# EAGLE design Breadboard (EAGLE 9.4.2)
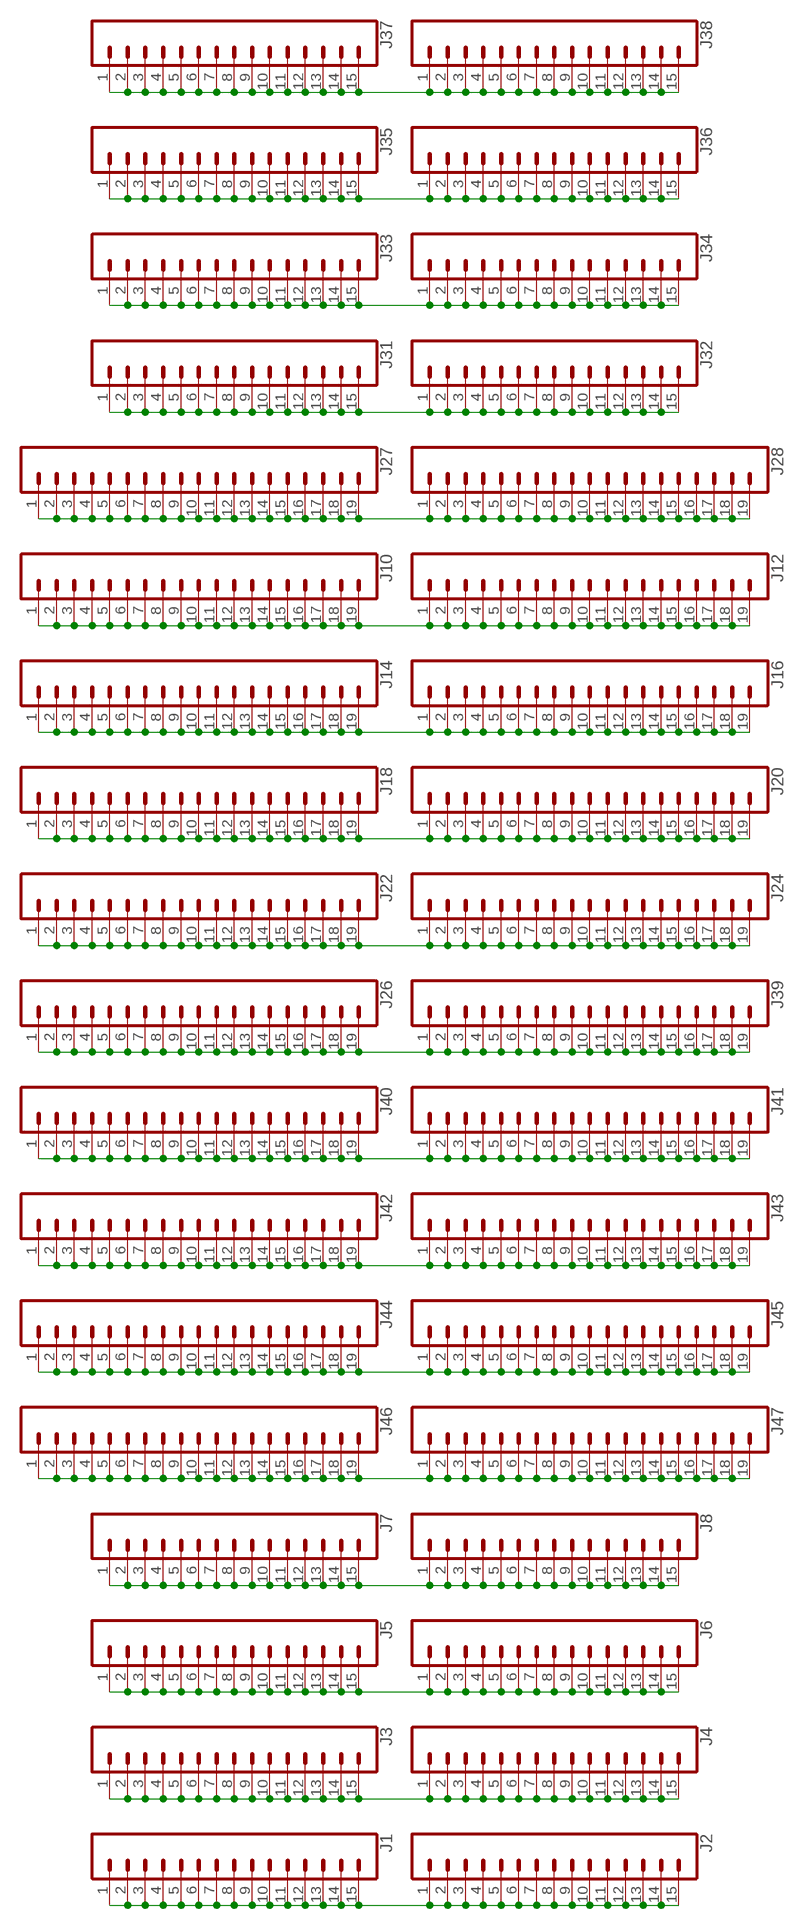
[diagram p0: schematic, sheet 1]

## Parts
J1  CONN_15  [1X15]
J2  CONN_15  [1X15]
J3  CONN_15  [1X15]
J4  CONN_15  [1X15]
J5  CONN_15  [1X15]
J6  CONN_15  [1X15]
J7  CONN_15  [1X15]
J8  CONN_15  [1X15]
J10  CONN_19  [1X19]
J12  CONN_19  [1X19]
J14  CONN_19  [1X19]
J16  CONN_19  [1X19]
J18  CONN_19  [1X19]
J20  CONN_19  [1X19]
J22  CONN_19  [1X19]
J24  CONN_19  [1X19]
J26  CONN_19  [1X19]
J27  CONN_19  [1X19]
J28  CONN_19  [1X19]
J31  CONN_15  [1X15]
J32  CONN_15  [1X15]
J33  CONN_15  [1X15]
J34  CONN_15  [1X15]
J35  CONN_15  [1X15]
J36  CONN_15  [1X15]
J37  CONN_15  [1X15]
J38  CONN_15  [1X15]
J39  CONN_19  [1X19]
J40  CONN_19  [1X19]
J41  CONN_19  [1X19]
J42  CONN_19  [1X19]
J43  CONN_19  [1X19]
J44  CONN_19  [1X19]
J45  CONN_19  [1X19]
J46  CONN_19  [1X19]
J47  CONN_19  [1X19]

## Nets
N$1: J37.1 J37.2 J37.3 J37.4 J37.5 J37.6 J37.7 J37.8 J37.9 J37.10 J37.11 J37.12 J37.13 J37.14 J37.15 J38.1 J38.2 J38.3 J38.4 J38.5 J38.6 J38.7 J38.8 J38.9 J38.10 J38.11 J38.12 J38.13 J38.14 J38.15
N$2: J35.1 J35.2 J35.3 J35.4 J35.5 J35.6 J35.7 J35.8 J35.9 J35.10 J35.11 J35.12 J35.13 J35.14 J35.15 J36.1 J36.2 J36.3 J36.4 J36.5 J36.6 J36.7 J36.8 J36.9 J36.10 J36.11 J36.12 J36.13 J36.14 J36.15
N$3: J33.1 J33.2 J33.3 J33.4 J33.5 J33.6 J33.7 J33.8 J33.9 J33.10 J33.11 J33.12 J33.13 J33.14 J33.15 J34.1 J34.2 J34.3 J34.4 J34.5 J34.6 J34.7 J34.8 J34.9 J34.10 J34.11 J34.12 J34.13 J34.14 J34.15
N$4: J31.1 J31.2 J31.3 J31.4 J31.5 J31.6 J31.7 J31.8 J31.9 J31.10 J31.11 J31.12 J31.13 J31.14 J31.15 J32.1 J32.2 J32.3 J32.4 J32.5 J32.6 J32.7 J32.8 J32.9 J32.10 J32.11 J32.12 J32.13 J32.14 J32.15
N$6: J27.1 J27.2 J27.3 J27.4 J27.5 J27.6 J27.7 J27.8 J27.9 J27.10 J27.11 J27.12 J27.13 J27.14 J27.15 J27.16 J27.17 J27.18 J27.19 J28.1 J28.2 J28.3 J28.4 J28.5 J28.6 J28.7 J28.8 J28.9 J28.10 J28.11 J28.12 J28.13 J28.14 J28.15 J28.16 J28.17 J28.18 J28.19
N$7: J10.1 J10.2 J10.3 J10.4 J10.5 J10.6 J10.7 J10.8 J10.9 J10.10 J10.11 J10.12 J10.13 J10.14 J10.15 J10.16 J10.17 J10.18 J10.19 J12.1 J12.2 J12.3 J12.4 J12.5 J12.6 J12.7 J12.8 J12.9 J12.10 J12.11 J12.12 J12.13 J12.14 J12.15 J12.16 J12.17 J12.18 J12.19
N$8: J14.1 J14.2 J14.3 J14.4 J14.5 J14.6 J14.7 J14.8 J14.9 J14.10 J14.11 J14.12 J14.13 J14.14 J14.15 J14.16 J14.17 J14.18 J14.19 J16.1 J16.2 J16.3 J16.4 J16.5 J16.6 J16.7 J16.8 J16.9 J16.10 J16.11 J16.12 J16.13 J16.14 J16.15 J16.16 J16.17 J16.18 J16.19
N$9: J18.1 J18.2 J18.3 J18.4 J18.5 J18.6 J18.7 J18.8 J18.9 J18.10 J18.11 J18.12 J18.13 J18.14 J18.15 J18.16 J18.17 J18.18 J18.19 J20.1 J20.2 J20.3 J20.4 J20.5 J20.6 J20.7 J20.8 J20.9 J20.10 J20.11 J20.12 J20.13 J20.14 J20.15 J20.16 J20.17 J20.18 J20.19
N$10: J22.1 J22.2 J22.3 J22.4 J22.5 J22.6 J22.7 J22.8 J22.9 J22.10 J22.11 J22.12 J22.13 J22.14 J22.15 J22.16 J22.17 J22.18 J22.19 J24.1 J24.2 J24.3 J24.4 J24.5 J24.6 J24.7 J24.8 J24.9 J24.10 J24.11 J24.12 J24.13 J24.14 J24.15 J24.16 J24.17 J24.18 J24.19
N$11: J26.1 J26.2 J26.3 J26.4 J26.5 J26.6 J26.7 J26.8 J26.9 J26.10 J26.11 J26.12 J26.13 J26.14 J26.15 J26.16 J26.17 J26.18 J26.19 J39.1 J39.2 J39.3 J39.4 J39.5 J39.6 J39.7 J39.8 J39.9 J39.10 J39.11 J39.12 J39.13 J39.14 J39.15 J39.16 J39.17 J39.18 J39.19
N$12: J40.1 J40.2 J40.3 J40.4 J40.5 J40.6 J40.7 J40.8 J40.9 J40.10 J40.11 J40.12 J40.13 J40.14 J40.15 J40.16 J40.17 J40.18 J40.19 J41.1 J41.2 J41.3 J41.4 J41.5 J41.6 J41.7 J41.8 J41.9 J41.10 J41.11 J41.12 J41.13 J41.14 J41.15 J41.16 J41.17 J41.18 J41.19
N$13: J42.1 J42.2 J42.3 J42.4 J42.5 J42.6 J42.7 J42.8 J42.9 J42.10 J42.11 J42.12 J42.13 J42.14 J42.15 J42.16 J42.17 J42.18 J42.19 J43.1 J43.2 J43.3 J43.4 J43.5 J43.6 J43.7 J43.8 J43.9 J43.10 J43.11 J43.12 J43.13 J43.14 J43.15 J43.16 J43.17 J43.18 J43.19
N$14: J44.1 J44.2 J44.3 J44.4 J44.5 J44.6 J44.7 J44.8 J44.9 J44.10 J44.11 J44.12 J44.13 J44.14 J44.15 J44.16 J44.17 J44.18 J44.19 J45.1 J45.2 J45.3 J45.4 J45.5 J45.6 J45.7 J45.8 J45.9 J45.10 J45.11 J45.12 J45.13 J45.14 J45.15 J45.16 J45.17 J45.18 J45.19
N$15: J46.1 J46.2 J46.3 J46.4 J46.5 J46.6 J46.7 J46.8 J46.9 J46.10 J46.11 J46.12 J46.13 J46.14 J46.15 J46.16 J46.17 J46.18 J46.19 J47.1 J47.2 J47.3 J47.4 J47.5 J47.6 J47.7 J47.8 J47.9 J47.10 J47.11 J47.12 J47.13 J47.14 J47.15 J47.16 J47.17 J47.18 J47.19
N$16: J7.1 J7.2 J7.3 J7.4 J7.5 J7.6 J7.7 J7.8 J7.9 J7.10 J7.11 J7.12 J7.13 J7.14 J7.15 J8.1 J8.2 J8.3 J8.4 J8.5 J8.6 J8.7 J8.8 J8.9 J8.10 J8.11 J8.12 J8.13 J8.14 J8.15
N$17: J5.1 J5.2 J5.3 J5.4 J5.5 J5.6 J5.7 J5.8 J5.9 J5.10 J5.11 J5.12 J5.13 J5.14 J5.15 J6.1 J6.2 J6.3 J6.4 J6.5 J6.6 J6.7 J6.8 J6.9 J6.10 J6.11 J6.12 J6.13 J6.14 J6.15
N$18: J3.1 J3.2 J3.3 J3.4 J3.5 J3.6 J3.7 J3.8 J3.9 J3.10 J3.11 J3.12 J3.13 J3.14 J3.15 J4.1 J4.2 J4.3 J4.4 J4.5 J4.6 J4.7 J4.8 J4.9 J4.10 J4.11 J4.12 J4.13 J4.14 J4.15
N$19: J1.1 J1.2 J1.3 J1.4 J1.5 J1.6 J1.7 J1.8 J1.9 J1.10 J1.11 J1.12 J1.13 J1.14 J1.15 J2.1 J2.2 J2.3 J2.4 J2.5 J2.6 J2.7 J2.8 J2.9 J2.10 J2.11 J2.12 J2.13 J2.14 J2.15

## Library data of the parts
J1-J8 J31-J38 = SparkFun-Connectors:CONN_15: Multi connection point. Often used as Generic Header-pin footprint for 0.1 inch spaced/style header connections On any of the 0.1 inch spaced packages, you can populate with these: Break Away Headers - Straight <https://www.sparkfun.com/products/116> (PRT-00116) Break Away Male Headers - Right Angle <https://www.sparkfun.com/products/553> (PRT-00553) Female Headers <https://www.sparkfun.com/products/115> (PRT-00115) Break Away Headers - Machine Pin <https://www.sparkfun.com/products/117> (PRT-00117) Break Away Female Headers - Swiss Machine Pin <https://www.sparkfun.com/products/743> (PRT-00743) For SCREWTERMINALS and SPRING TERMINALS visit here: Screw Terimnals on SparkFun.com <https://www.sparkfun.com/search/results?term=Screw+Terminals> (5mm/3.5mm/2.54mm spacing) This device is also useful as a general connection point to wire up your design to another part of your project. Our various solder wires solder well into these plated through hole pads. Hook-Up Wire - Assortment (Stranded, 22 AWG) <https://www.sparkfun.com/products/11375> (PRT-11375) Hook-Up Wire - Assortment (Solid Core, 22 AWG) <https://www.sparkfun.com/products/11367> (PRT-11367) View the entire wire category on our website here <https://www.sparkfun.com/categories/141> Special notes: Molex polarized connector foot print use with SKU : PRT-08231 with associated crimp pins and housings. 1MM SMD Version SKU: PRT-10208 NOTES ON THE VARIANTS LOCK and LOCK_LONGPADS... This footprint was designed to help hold the alignment of a through-hole component (i.e. 6-pin header) while soldering it into place. You may notice that each hole has been shifted either up or down by 0.005 of an inch from it's more standard position (which is a perfectly straight line). This slight alteration caused the pins (the squares in the middle) to touch the edges of the holes. Because they are alternating, it causes a "brace" to hold the component in place. 0.005 has proven to be the perfect amount of "off-center" position when using our standard breakaway headers. Although looks a little odd when you look at the bare footprint, once you have a header in there, the alteration is very hard to notice. Also,if you push a header all the way into place, it is covered up entirely on the bottom side.
J10 J12 J14 J16 J18 J20 J22 J24 J26-J28 J39-J47 = SparkFun-Connectors:CONN_19: Multi connection point. Often used as Generic Header-pin footprint for 0.1 inch spaced/style header connections On any of the 0.1 inch spaced packages, you can populate with these: Break Away Headers - Straight <https://www.sparkfun.com/products/116> (PRT-00116) Break Away Male Headers - Right Angle <https://www.sparkfun.com/products/553> (PRT-00553) Female Headers <https://www.sparkfun.com/products/115> (PRT-00115) Break Away Headers - Machine Pin <https://www.sparkfun.com/products/117> (PRT-00117) Break Away Female Headers - Swiss Machine Pin <https://www.sparkfun.com/products/743> (PRT-00743) For SCREWTERMINALS and SPRING TERMINALS visit here: Screw Terimnals on SparkFun.com <https://www.sparkfun.com/search/results?term=Screw+Terminals> (5mm/3.5mm/2.54mm spacing) This device is also useful as a general connection point to wire up your design to another part of your project. Our various solder wires solder well into these plated through hole pads. Hook-Up Wire - Assortment (Stranded, 22 AWG) <https://www.sparkfun.com/products/11375> (PRT-11375) Hook-Up Wire - Assortment (Solid Core, 22 AWG) <https://www.sparkfun.com/products/11367> (PRT-11367) View the entire wire category on our website here <https://www.sparkfun.com/categories/141> Special notes: Molex polarized connector foot print use with SKU : PRT-08231 with associated crimp pins and housings. 1MM SMD Version SKU: PRT-10208 NOTES ON THE VARIANTS LOCK and LOCK_LONGPADS... This footprint was designed to help hold the alignment of a through-hole component (i.e. 6-pin header) while soldering it into place. You may notice that each hole has been shifted either up or down by 0.005 of an inch from it's more standard position (which is a perfectly straight line). This slight alteration caused the pins (the squares in the middle) to touch the edges of the holes. Because they are alternating, it causes a "brace" to hold the component in place. 0.005 has proven to be the perfect amount of "off-center" position when using our standard breakaway headers. Although looks a little odd when you look at the bare footprint, once you have a header in there, the alteration is very hard to notice. Also,if you push a header all the way into place, it is covered up entirely on the bottom side.

## Board
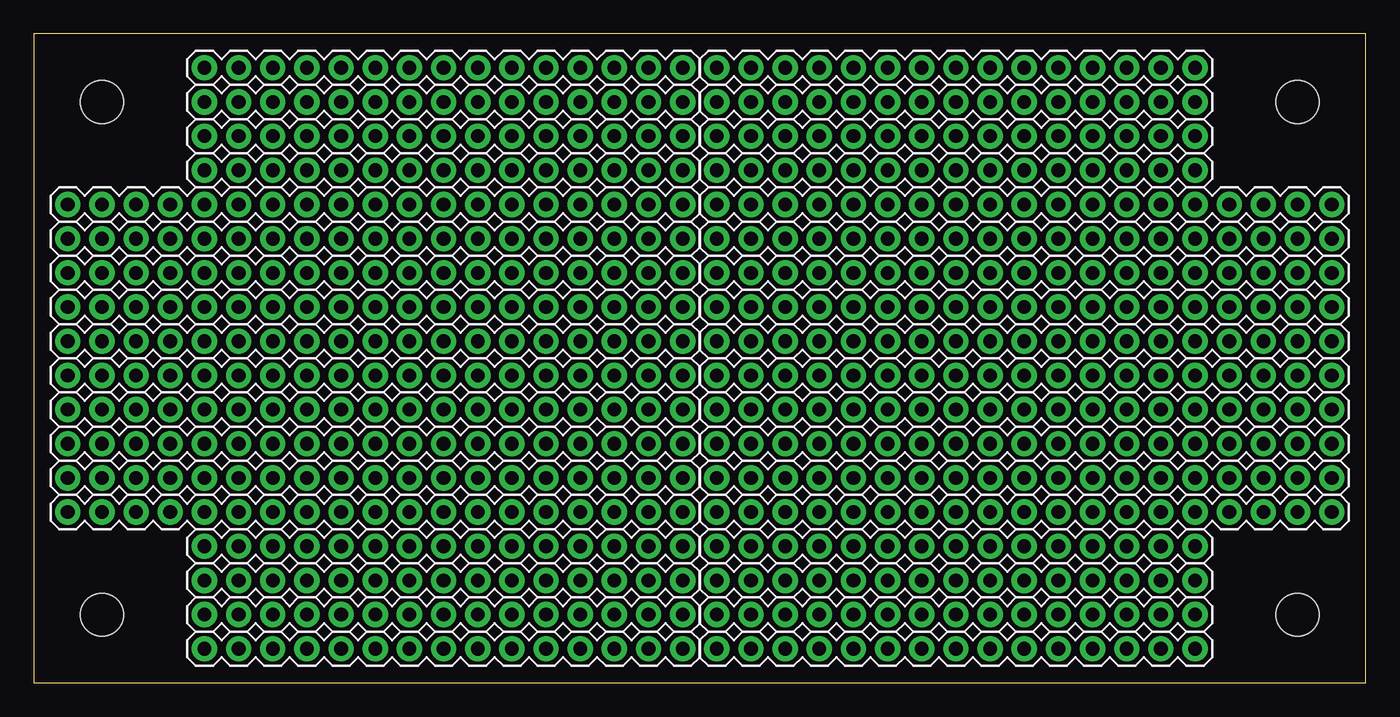
[diagram p1: board, top side]
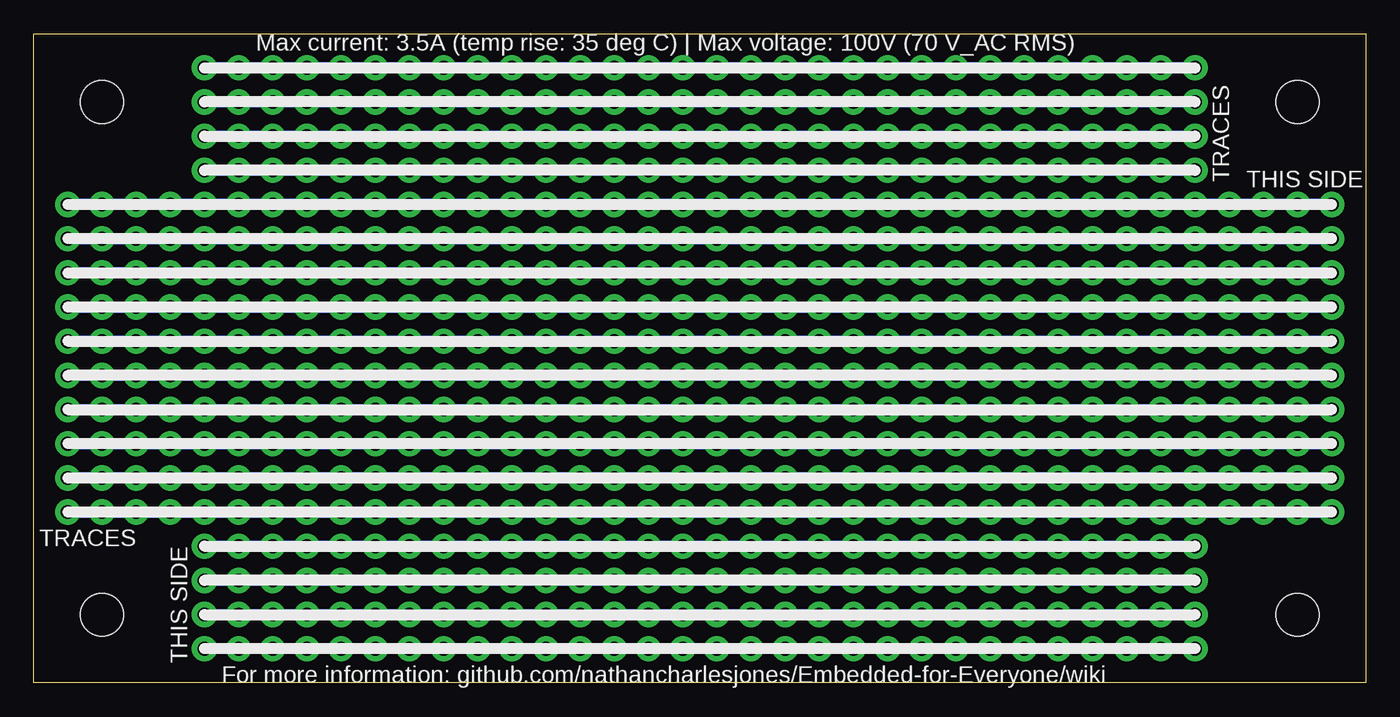
[diagram p2: board, bottom side, seen from below]

Size 99.06 x 48.26 mm. Coordinates in mm from the lower left corner, seen from the top.
Outline: 0,0 99.06,0 99.06,48.26 0,48.26 0,0
Copper layers (1*16): Top 0.035mm / dielectric 1.5mm / Bottom 0.035mm
Design rules "OthermillDRC_1_64_v2": minimum track width 16mil, minimum drill 31mil, track to track 0.39878125mm, track to pad 0.39878125mm, pad to pad 0.39878125mm, via to via 0.39878125mm, smd to smd 0mil, copper to edge 0mil, drill to drill 1mil, minimum pad ring 0mil, minimum via ring 15mil, stop-mask expansion 1mil, vias tented up to drill 30mil, thermal gap 10mil
Holes 3.17 mm at 93.98,43.18 93.98,5.08 5.08,43.18 5.08,5.08

### Footprints (pad centres in the part's own frame; a part is rotated, then mirrored left to right if it is on the bottom)
1X15 = drill 1.016 pad 1.88: 1 0,0; 2 2.54,0; 3 5.08,0; 4 7.62,0; 5 10.16,0; 6 12.7,0; 7 15.24,0; 8 17.78,0; 9 20.32,0; 10 22.86,0; 11 25.4,0; 12 27.94,0; 13 30.48,0; 14 33.02,0; 15 35.56,0
1X19 = drill 1.016 pad 1.88: 1 0,0; 2 2.54,0; 3 5.08,0; 4 7.62,0; 5 10.16,0; 6 12.7,0; 7 15.24,0; 8 17.78,0; 9 20.32,0; 10 22.86,0; 11 25.4,0; 12 27.94,0; 13 30.48,0; 14 33.02,0; 15 35.56,0; 16 38.1,0; 17 40.64,0; 18 43.18,0; 19 45.72,0

### Placement (x,y rotation side)
J1  12.7,2.54 0 top
J2  50.8,2.54 0 top
J3  12.7,5.08 0 top
J4  50.8,5.08 0 top
J5  12.7,7.62 0 top
J6  50.8,7.62 0 top
J7  12.7,10.16 0 top
J8  50.8,10.16 0 top
J10  2.54,33.02 0 top
J12  50.8,33.02 0 top
J14  2.54,30.48 0 top
J16  50.8,30.48 0 top
J18  2.54,27.94 0 top
J20  50.8,27.94 0 top
J22  2.54,25.4 0 top
J24  50.8,25.4 0 top
J26  2.54,22.86 0 top
J27  2.54,35.56 0 top
J28  50.8,35.56 0 top
J31  12.7,38.1 0 top
J32  50.8,38.1 0 top
J33  12.7,40.64 0 top
J34  50.8,40.64 0 top
J35  12.7,43.18 0 top
J36  50.8,43.18 0 top
J37  12.7,45.72 0 top
J38  50.8,45.72 0 top
J39  50.8,22.86 0 top
J40  2.54,20.32 0 top
J41  50.8,20.32 0 top
J42  2.54,17.78 0 top
J43  50.8,17.78 0 top
J44  2.54,15.24 0 top
J45  50.8,15.24 0 top
J46  2.54,12.7 0 top
J47  50.8,12.7 0 top

### Tracks (layer width: path | path; a pad name or v marks a point on that pad's centre or on a via)
N$1
  Bottom 0.813: J37.1 J37.2 J37.3 J37.4 J37.5 J37.6 J37.7 J37.8 J37.9 J37.10 J37.11 J37.12 J37.13 J37.14 J37.15 J38.1 J38.2 J38.3 J38.4 J38.5 J38.6 J38.7 J38.8 J38.9 J38.10 J38.11 J38.12 J38.13 J38.14 J38.15
N$2
  Bottom 0.813: J36.15 J36.14 J36.13 J36.12 J36.11 J36.10 J36.9 J36.8 J36.7 J36.6 J36.5 J36.4 J36.3 J36.2 J36.1 J35.15 J35.14 J35.13 J35.12 J35.11 J35.10 J35.9 J35.8 J35.7 J35.6 J35.5 J35.4 J35.3 J35.2 J35.1
N$3
  Bottom 0.813: J33.1 J33.2 J33.3 J33.4 J33.5 J33.6 J33.7 J33.8 J33.9 J33.10 J33.11 J33.12 J33.13 J33.14 J33.15 J34.1 J34.2 J34.3 J34.4 J34.5 J34.6 J34.7 J34.8 J34.9 J34.10 J34.11 J34.12 J34.13 J34.14 J34.15
N$4
  Bottom 0.813: J32.15 J32.14 J32.13 J32.12 J32.11 J32.10 J32.9 J32.8 J32.7 J32.6 J32.5 J32.4 J32.3 J32.2 J32.1 J31.15 J31.14 J31.13 J31.12 J31.11 J31.10 J31.9 J31.8 J31.7 J31.6 J31.5 J31.4 J31.3 J31.2 J31.1
N$6
  Bottom 0.813: J27.1 J27.2 J27.3 J27.4 J27.5 J27.6 J27.7 J27.8 J27.9 J27.10 J27.11 J27.12 J27.13 J27.14 J27.15 J27.16 J27.17 J27.18 J27.19 J28.1 J28.2 J28.3 J28.4 J28.5 J28.6 J28.7 J28.8 J28.9 J28.10 J28.11 J28.12 J28.13 J28.14 J28.15 J28.16 J28.17 J28.18 J28.19
N$7
  Bottom 0.813: J12.19 J12.18 J12.17 J12.16 J12.15 J12.14 J12.13 J12.12 J12.11 J12.10 J12.9 J12.8 J12.7 J12.6 J12.5 J12.4 J12.3 J12.2 J12.1 J10.19 J10.18 J10.17 J10.16 J10.15 J10.14 J10.13 J10.12 J10.11 J10.10 J10.9 J10.8 J10.7 J10.6 J10.5 J10.4 J10.3 J10.2 J10.1
N$8
  Bottom 0.813: J14.1 J14.2 J14.3 J14.4 J14.5 J14.6 J14.7 J14.8 J14.9 J14.10 J14.11 J14.12 J14.13 J14.14 J14.15 J14.16 J14.17 J14.18 J14.19 J16.1 J16.2 J16.3 J16.4 J16.5 J16.6 J16.7 J16.8 J16.9 J16.10 J16.11 J16.12 J16.13 J16.14 J16.15 J16.16 J16.17 J16.18 J16.19
N$9
  Bottom 0.813: J20.19 J20.18 J20.17 J20.16 J20.15 J20.14 J20.13 J20.12 J20.11 J20.10 J20.9 J20.8 J20.7 J20.6 J20.5 J20.4 J20.3 J20.2 J20.1 J18.19 J18.18 J18.17 J18.16 J18.15 J18.14 J18.13 J18.12 J18.11 J18.10 J18.9 J18.8 J18.7 J18.6 J18.5 J18.4 J18.3 J18.2 J18.1
N$10
  Bottom 0.813: J22.1 J22.2 J22.3 J22.4 J22.5 J22.6 J22.7 J22.8 J22.9 J22.10 J22.11 J22.12 J22.13 J22.14 J22.15 J22.16 J22.17 J22.18 J22.19 J24.1 J24.2 J24.3 J24.4 J24.5 J24.6 J24.7 J24.8 J24.9 J24.10 J24.11 J24.12 J24.13 J24.14 J24.15 J24.16 J24.17 J24.18 J24.19
N$11
  Bottom 0.813: J39.19 J39.18 J39.17 J39.16 J39.15 J39.14 J39.13 J39.12 J39.11 J39.10 J39.9 J39.8 J39.7 J39.6 J39.5 J39.4 J39.3 J39.2 J39.1 J26.19 J26.18 J26.17 J26.16 J26.15 J26.14 J26.13 J26.12 J26.11 J26.10 J26.9 J26.8 J26.7 J26.6 J26.5 J26.4 J26.3 J26.2 J26.1
N$12
  Bottom 0.813: J40.1 J40.2 J40.3 J40.4 J40.5 J40.6 J40.7 J40.8 J40.9 J40.10 J40.11 J40.12 J40.13 J40.14 J40.15 J40.16 J40.17 J40.18 J40.19 J41.1 J41.2 J41.3 J41.4 J41.5 J41.6 J41.7 J41.8 J41.9 J41.10 J41.11 J41.12 J41.13 J41.14 J41.15 J41.16 J41.17 J41.18 J41.19
N$13
  Bottom 0.813: J43.19 J43.18 J43.17 J43.16 J43.15 J43.14 J43.13 J43.12 J43.11 J43.10 J43.9 J43.8 J43.7 J43.6 J43.5 J43.4 J43.3 J43.2 J43.1 J42.19 J42.18 J42.17 J42.16 J42.15 J42.14 J42.13 J42.12 J42.11 J42.10 J42.9 J42.8 J42.7 J42.6 J42.5 J42.4 J42.3 J42.2 J42.1
N$14
  Bottom 0.813: J44.1 J44.2 J44.3 J44.4 J44.5 J44.6 J44.7 J44.8 J44.9 J44.10 J44.11 J44.12 J44.13 J44.14 J44.15 J44.16 J44.17 J44.18 J44.19 J45.1 J45.2 J45.3 J45.4 J45.5 J45.6 J45.7 J45.8 J45.9 J45.10 J45.11 J45.12 J45.13 J45.14 J45.15 J45.16 J45.17 J45.18 J45.19
N$15
  Bottom 0.813: J47.19 J47.18 J47.17 J47.16 J47.15 J47.14 J47.13 J47.12 J47.11 J47.10 J47.9 J47.8 J47.7 J47.6 J47.5 J47.4 J47.3 J47.2 J47.1 J46.19 J46.18 J46.17 J46.16 J46.15 J46.14 J46.13 J46.12 J46.11 J46.10 J46.9 J46.8 J46.7 J46.6 J46.5 J46.4 J46.3 J46.2 J46.1
N$16
  Bottom 0.813: J7.1 J7.2 J7.3 J7.4 J7.5 J7.6 J7.7 J7.8 J7.9 J7.10 J7.11 J7.12 J7.13 J7.14 J7.15 J8.1 J8.2 J8.3 J8.4 J8.5 J8.6 J8.7 J8.8 J8.9 J8.10 J8.11 J8.12 J8.13 J8.14 J8.15
N$17
  Bottom 0.813: J6.15 J6.14 J6.13 J6.12 J6.11 J6.10 J6.9 J6.8 J6.7 J6.6 J6.5 J6.4 J6.3 J6.2 J6.1 J5.15 J5.14 J5.13 J5.12 J5.11 J5.10 J5.9 J5.8 J5.7 J5.6 J5.5 J5.4 J5.3 J5.2 J5.1
N$18
  Bottom 0.813: J3.1 J3.2 J3.3 J3.4 J3.5 J3.6 J3.7 J3.8 J3.9 J3.10 J3.11 J3.12 J3.13 J3.14 J3.15 J4.1 J4.2 J4.3 J4.4 J4.5 J4.6 J4.7 J4.8 J4.9 J4.10 J4.11 J4.12 J4.13 J4.14 J4.15
N$19
  Bottom 0.813: J1.1 J1.2 J1.3 J1.4 J1.5 J1.6 J1.7 J1.8 J1.9 J1.10 J1.11 J1.12 J1.13 J1.14 J1.15 J2.1 J2.2 J2.3 J2.4 J2.5 J2.6 J2.7 J2.8 J2.9 J2.10 J2.11 J2.12 J2.13 J2.14 J2.15

### Text on the board
bNames: Max current: 3.5A (temp rise: 35 deg C) | Max voltage: 100V (70 V_AC RMS) | TRACES | THIS SIDE | TRACES | THIS SIDE | For more information: github.com/nathancharlesjones/Embedded-for-Everyone/wiki